# Altium schematic sheet Analog_In.SchDoc
size 209 x 297 mm; DocumentNumber: САНП.*; _Razrabotal: {Разработал}; _Proveril: {Проверил}; _TKontr: {Т.контр}; _NKontr: {Н.контр}; _Utverdil: {Утвердил}
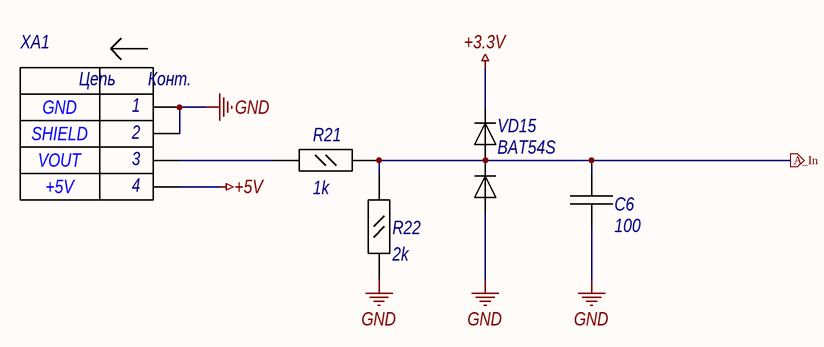
[diagram p0: Analog_In.SchDoc]

## Parts
C6  100  [0805]
R21  1k  [0805]
R22  2k  [0805]
VD15  BAT54S  [SOT-23]
XA1  CWF-4  [CWF-4]  (value not drawn)

## Ports
A_In

## Nets
+3.3V: VD15.2(K)
+5V: XA1.4
GND: C6.2 R22.1 VD15.1(A) XA1.1 XA1.2
A_In: C6.1 R21.2 R22.2 VD15.3(AK) ; port A_In
NetR21_1: R21.1 XA1.3

## Notes on the sheet
- GND
- VOUT
- SHIELD
- +5V
- Перв. примен.
- Справ. №
- Подп. и дата
- Инв.№ дубл.
- Взам. инв.№
- Инв. № подп.
- Лист
- Изм.
- № докум.
- Подпись
- Дата
- Копировал
- Формат      А4
- (in symbol CWF-4) Цепь; Конт.

## Library data of the parts
C6 = CC0805: Manufacturer: YAGEO; Accuracy: 10%; CVoltage: 50 В; TC Material: X7R; ComponentName: СС0805; PackageName: 0805; ComponentType: Конденсатор; Value: 100
R21 R22 = RC0805JR: Резистор общего назначения 5%; Manufacturer: YAGEO; PackageName: 0805; ComponentType: Резистор; Accuracy: 5%; ComponentName: RC0805JR
  R21: Value: 1k
  R22: Value: 2k
VD15 = BAT54S: Диоды Шотки; Manufacturer: NXP; PackageName: SOT-23; ComponentType: Диод; ComponentName: BAT54S
XA1 = CWF-4: Разъем питания, шаг 2.5мм; ComponentType: Разъем; ComponentName: CWF-4